# Altium schematic sheet 05. 4G Module.SchDoc
size A3
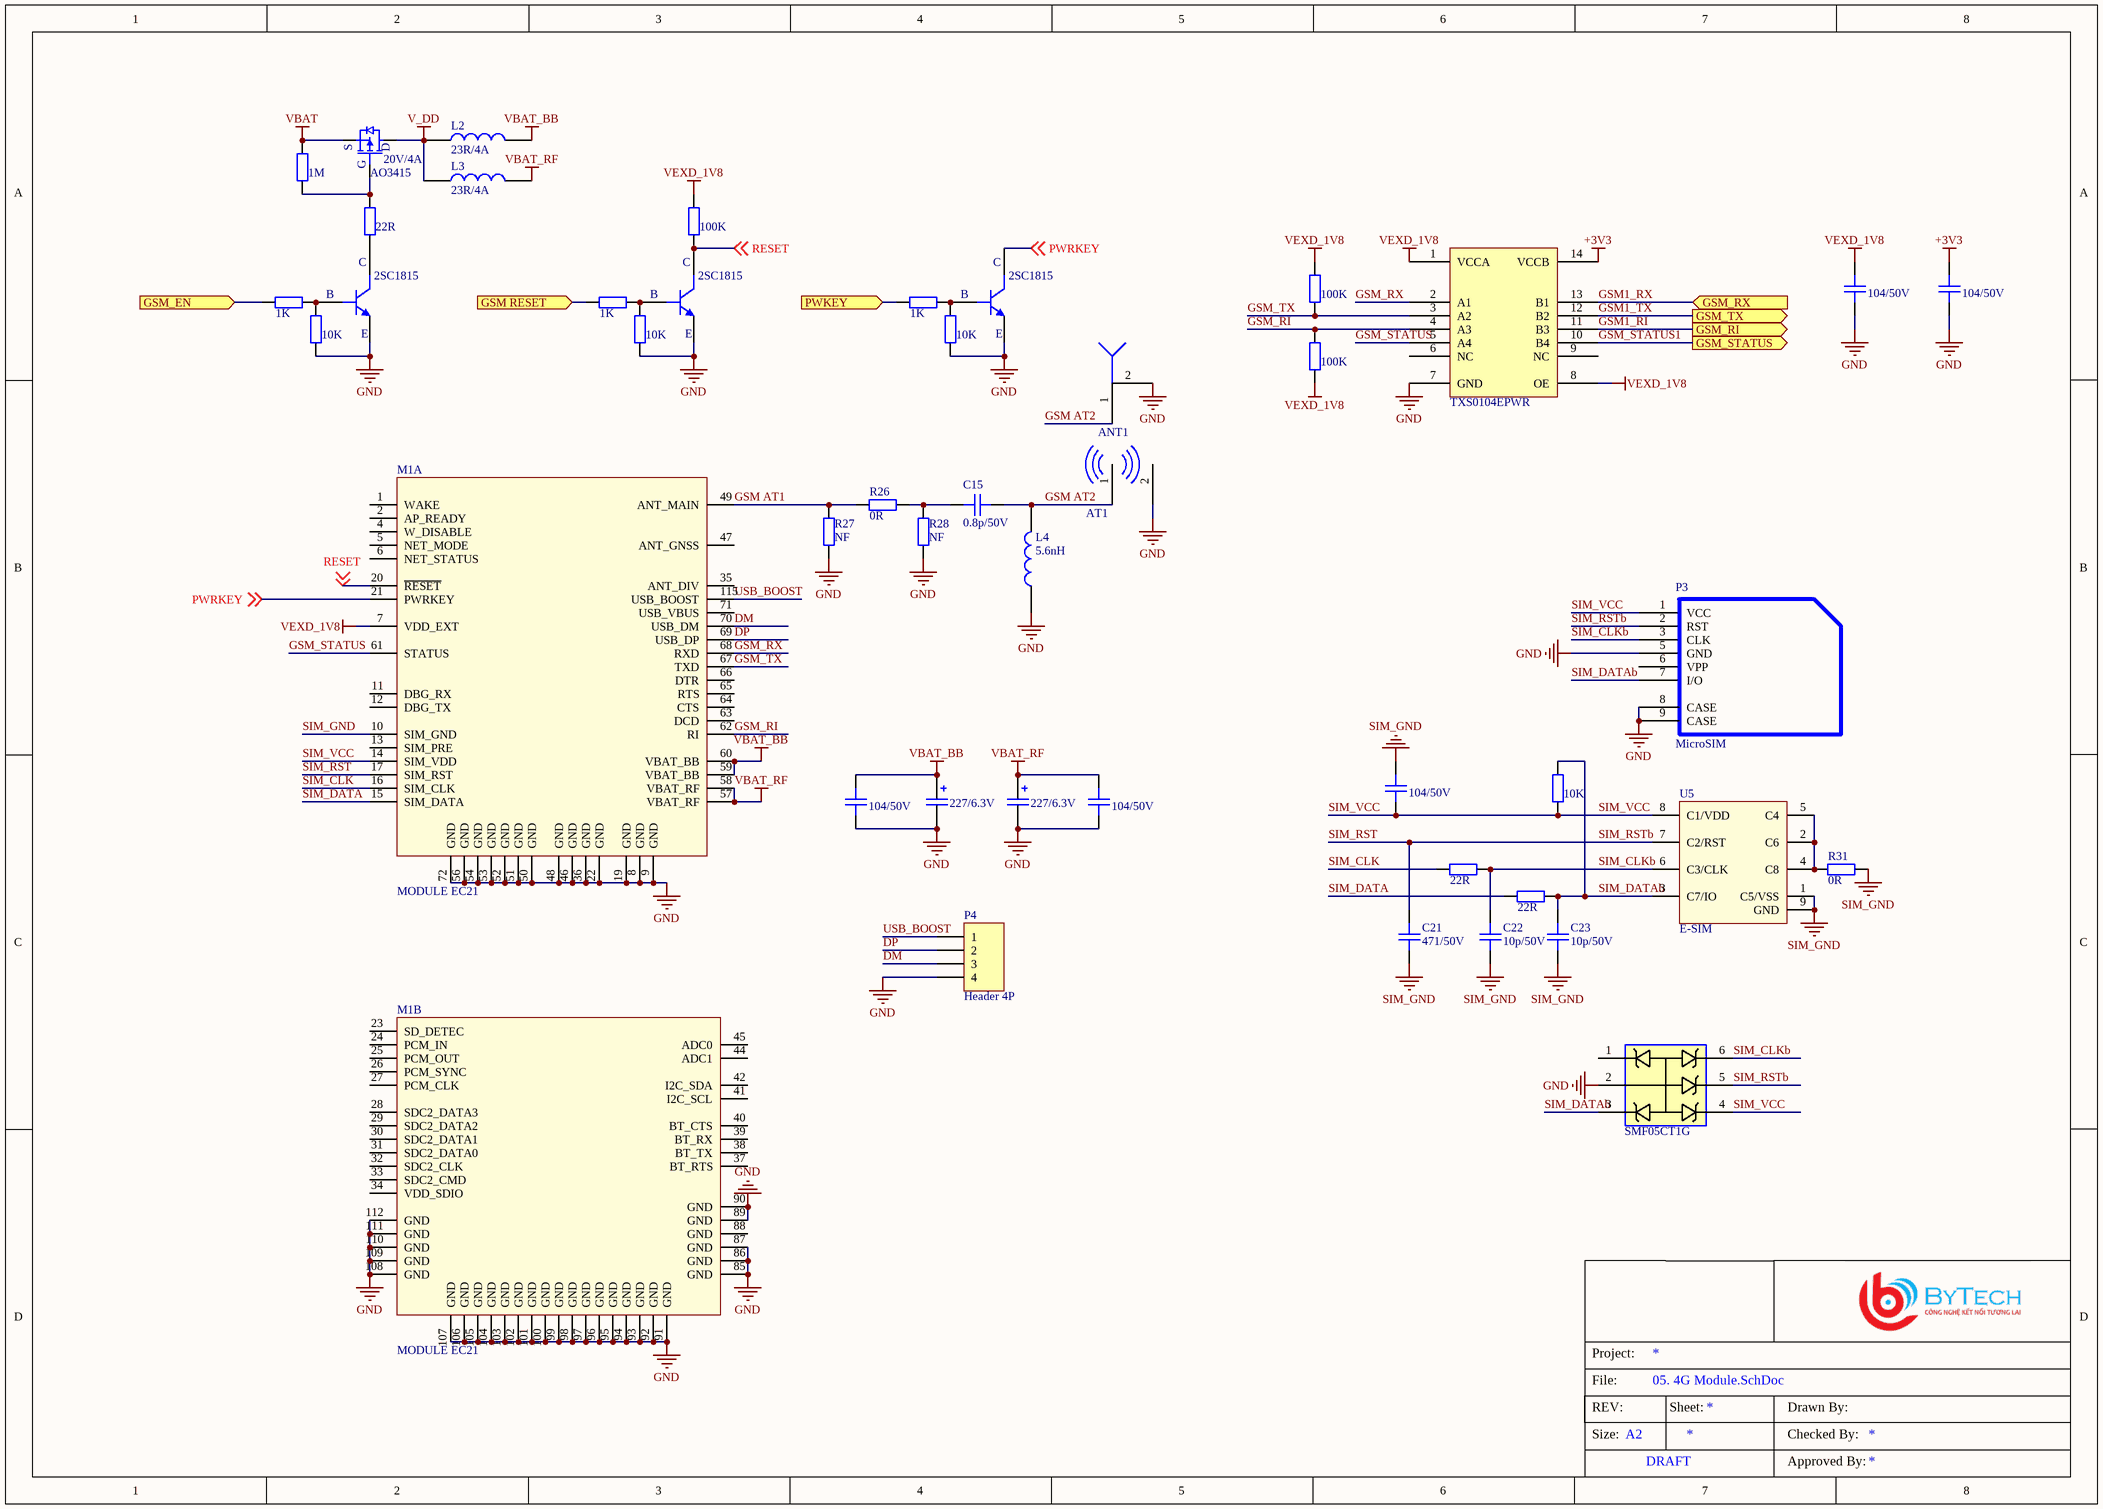
[diagram p0: 05. 4G Module.SchDoc]

## Parts
ANT1  (no value)  [Antenna 4G]
AT1  IPEX_CON  [ANTENNA - IPEX SMD]  (value not drawn)
C13  104/50V  [CAPC-0603 (1608)]
C14  104/50V  [CAPC-0603 (1608)]
C15  0.8p/50V  [CAPC-0603 (1608)]
C16  104/50V  [CAPC-0603 (1608)]
C17  227/6.3V  [CAP_TANTAL_1210(3528)]
C18  227/6.3V  [CAP_TANTAL_1210(3528)]
C19  104/50V  [CAPC-0603 (1608)]
C20  104/50V  [CAPC-0603 (1608)]
C21  471/50V  [CAPC-0603 (1608)]
C22  10p/50V  [CAPC-0603 (1608)]
C23  10p/50V  [CAPC-0603 (1608)]
D5  20V/4A  [SOT23_3]
L2  23R/4A  [IND-0603 (1608)]
L3  23R/4A  [IND-0603 (1608)]
L4  5.6nH  [IND-0603 (1608)]
M1  MODULE EC21  [EC21]  (parts A,B of 3)
P3  MicroSIM  [MUP-C792]
P4  Header 4P  [HDR1X4]
Q1  2SC1815  [SOT23_3]
Q2  2SC1815  [SOT23_3]
Q3  2SC1815  [SOT23_3]
R15  1M  [RESC-0603 (1608)]
R16  22R  [RESC-0603 (1608)]
R17  100K  [RESC-0603 (1608)]
R18  100K  [RESC-0603 (1608)]
R19  1K  [RESC-0603 (1608)]
R20  1K  [RESC-0603 (1608)]
R21  1K  [RESC-0603 (1608)]
R22  10K  [RESC-0603 (1608)]
R23  10K  [RESC-0603 (1608)]
R24  10K  [RESC-0603 (1608)]
R25  100K  [RESC-0603 (1608)]
R26  0R  [RESC-0603 (1608)]
R27  NF  [RESC-0603 (1608)]
R28  NF  [RESC-0603 (1608)]
R29  10K  [RESC-0603 (1608)]
R30  22R  [RESC-0603 (1608)]
R31  0R  [RESC-0603 (1608)]
R32  22R  [RESC-0603 (1608)]
U4  TXS0104EPWR  [TSOP65P640X120-14N]
U5  E-SIM  [MFF2 ESIM]
U6  SMF05CT1G  [SOT363]

## Ports
GSM RESET (in), GSM_EN (in), GSM_RI (out), GSM_RX (in), GSM_STATUS (out), GSM_TX (out), PWKEY (in)

## Nets
+3V3: C14.1 U4.14(VCCB)
GND: ANT1.2 AT1.2 C13.2 C14.2 C17.2 C18.2 C19.2 C20.2 L4.1 M1.8(GND) M1.9(GND) M1.19(GND) M1.22(GND) M1.36(GND) M1.46(GND) M1.48(GND) M1.50(GND) M1.51(GND) M1.52(GND) M1.53(GND) M1.54(GND) M1.56(GND) M1.72(GND) M1.85(GND) M1.86(GND) M1.87(GND) M1.89(GND) M1.90(GND) M1.91(GND) M1.92(GND) M1.93(GND) M1.94(GND) M1.95(GND) M1.96(GND) M1.97(GND) M1.98(GND) M1.99(GND) M1.100(GND) M1.101(GND) M1.102(GND) M1.103(GND) M1.104(GND) M1.105(GND) M1.106(GND) M1.107(GND) M1.108(GND) M1.109(GND) M1.110(GND) M1.111(GND) M1.112(GND) P3.5(GND) P3.8(CASE) P3.9(CASE) P4.4 Q1.2(E) Q2.2(E) Q3.2(E) R22.1 R23.1 R24.1 R27.1 R28.1 U4.7(GND) U6.2(AN)
SIM_GND: C16.1 C21.1 C22.1 C23.1 M1.10(SIM_GND) R31.2 U5.1(C5/VSS) U5.9(GND)
V_DD: D5.3(D) L2.1 L3.1
VBAT: D5.2(S) R15.2
VBAT_BB: C17.1 C19.1 L2.2 M1.59(VBAT_BB) M1.60(VBAT_BB)
VBAT_RF: C18.1 C20.1 L3.2 M1.57(VBAT_RF) M1.58(VBAT_RF)
VEXD_1V8: C13.1 M1.7(VDD_EXT) R17.2 R18.2 R25.2 U4.1(VCCA) U4.8(OE)
DM: M1.70(USB_DM) P4.3
DP: M1.69(USB_DP) P4.2
GSM1_RI: U4.11(B3) ; port GSM_RI
GSM1_RX: U4.13(B1) ; port GSM_RX
GSM1_TX: U4.12(B2) ; port GSM_TX
GSM AT1: M1.49(ANT_MAIN) R26.1 R27.2
GSM AT2: ANT1.1 AT1.1(AT) C15.2 L4.2
GSM RESET: R20.1 ; port GSM RESET
GSM_EN: R19.1 ; port GSM_EN
GSM_RI: M1.62(RI) R25.1 U4.4(A3)
GSM_RX: M1.68(RXD) U4.2(A1)
GSM_STATUS: M1.61(STATUS) U4.5(A4)
GSM_STATUS1: U4.10(B4) ; port GSM_STATUS
GSM_TX: M1.67(TXD) R18.1 U4.3(A2)
PWKEY: R21.1 ; port PWKEY
PWRKEY: M1.21(PWRKEY) Q3.3(C) ; off-sheet PWRKEY
RESET: M1.20(~{RESET}) Q2.3(C) R17.1 ; off-sheet RESET
SIM_CLK: M1.16(SIM_CLK) R30.1
SIM_CLKb: C22.2 P3.3(CLK) R30.2 U5.6(C3/CLK) U6.6(CT5)
SIM_DATA: M1.15(SIM_DATA) R32.1
SIM_DATAb: C23.2 P3.7(I/O) R29.2 R32.2 U5.3(C7/IO) U6.3(CT2)
SIM_RST: C21.2 M1.17(SIM_RST) P3.2(RST) U5.7(C2/RST) U6.5(CT4)  [also labelled SIM_RSTb]
SIM_VCC: C16.2 M1.14(SIM_VDD) P3.1(VCC) R29.1 U5.8(C1/VDD) U6.4(CT3)
USB_BOOST: M1.115(USB_BOOST) P4.1
NetC15_1: C15.1 R26.2 R28.2
NetD5_1: D5.1(G) R15.1 R16.2
NetQ1_1: Q1.1(B) R19.2 R22.2
NetQ1_3: Q1.3(C) R16.1
NetQ2_1: Q2.1(B) R20.2 R23.2
NetQ3_1: Q3.1(B) R21.2 R24.2
NetR31_1: R31.1 U5.2(C6) U5.4(C8) U5.5(C4)

Not connected (* = marked no-connect by the designer): M1 1(WAKE) 2(AP_READY) 4(W_DISABLE) 5(NET_MODE) 6(NET_STATUS) 11(DBG_RX) 12(DBG_TX) 13(SIM_PRE) 23(SD_DETEC) 24(PCM_IN) 25(PCM_OUT) 26(PCM_SYNC) 27(PCM_CLK) 28(SDC2_DATA3) 29(SDC2_DATA2) 30(SDC2_DATA1) 31(SDC2_DATA0) 32(SDC2_CLK) 33(SDC2_CMD) 34(VDD_SDIO) 35(ANT_DIV) 37(BT_RTS) 38(BT_TX) 39(BT_RX) 40(BT_CTS) 41(I2C_SCL) 42(I2C_SDA) 44(ADC1) 45(ADC0) 47(ANT_GNSS) 63(DCD) 64(CTS) 65(RTS) 66(DTR) 71(USB_VBUS) 88(GND); P3 6(VPP); U4 6(NC) 9(NC); U6 1(CT1)

## Notes on the sheet
- File:
- Project:
- REV:
- Size:
- A2
- Sheet:
- Drawn By:
- Checked By:
- DRAFT
- Approved By:

## Library data of the parts
ANT1 = PCB 4G CLONE: MPN: PCB 4G CLONE
AT1 = MUP-R4151: IPEX CONNECTER ANTENNA GPS GSM; MFR: MUP CONNECTOR; Solder: SMT; MPN: MUP-R4151; Value: IPEX_CON
C13 C14 C16 C19 C20 = C0603C104K5RACTU: CAP CER 0.1uF 50V 10% X7R 0603; CompanyID: VT-00982; Solder: SMT; MPN: C0603C104K5RACTU; Value: 104/50V
C15 = GRM1885C1HR80BA01D: CAP CER 0.8PF 50V C0G/NP0 0603; MFR: Murata Electronics; Solder: SMT; MPN: GRM1885C1HR80BA01D; Value: 0.8p/50V
C17 C18 = T520B227M006ATE035: CAP TANT POLY 220uF 20% 6.3V 3528 35mOhm ESR; Solder: SMT; CompanyID: VT-00643; Value: 227/6.3V; MPN: T520B227M006ATE035
C21 = CL10B471KB8NNNC: CAP CER 470pF 10% 50V X7R 0603; Solder: SMT; Company ID: VT00072; MPN: CL10B471KB8NNNC; Value: 471/50V
C22 C23 = CL10C100JB8NNND: CAP CER 10pF 5% 50V NP0 0603; Solder: SMT; Company ID: VT00076; Value: 10p/50V; MPN: CL10C100JB8NNND
D5 = AO3415: MOSFET P-CH 20V 4A SOT23; MFR: Alpha & Omega Semiconductor Inc.; CATEGORY: DIODE; SOLDER: SOT23; VALUE: 20V/4A; MPN: AO3415
L2 L3 = FBMJ1608HM230NT: IND-FERRITE BEAD 23 OHM  4A 0603 1LN; Solder: SMT; Company ID: VT00326; MPN: FBMJ1608HM230NT; Value: 23R/4A
L4 = 7447860056: FIXED IND 5.6NH 300MA 180 MOHM; MFR: Würth Elektronik; MPN: 7447860056; SOLDER: IND-0603; CATEGORY: INDUCTOR; Value: 5.6nH; Company ID: *
M1 = QUECTEL EC21: Quectel EC21 is a series of LTE category; MPN: EC21-CN; SOLDER: SMT; MFR: QUECTEL; CATEGORY: IC
P3 = MUP-C792: MicroSIM Card Push - Push Holder; MFR: MUPCONNECTOR; Company ID: VT00135; Solder: SMT; MPN: MUP-C792; Value: MUP-C792
P4 = Header 4x1: Header, 4 Pin Pitch 2.54mm; MPN: S1012EC-40-ND; Company ID: VT-00125; Solder: WAVE; Value: Header 4P
Q1-Q3 = 2SC1815: TRANS NPN 50V 0.15A SOT23-3; Solder: SMT; MPN: 2SC1815; Value: 2SC1815
R15 = CRCW06031M00FKEA: RES SMD 1M OHM 1% 1/10W 0603; CompanyID: VT-00325; Solder: SMT; MPN: CRCW06031M00FKEA; Value: 1M
R16 R30 R32 = RC0603FR-0722RL: RES SMD 22 OHM 1% 1/10W 0603; CompanyID: VT-00881; Solder: SMT; Value: 22R; MPN: RC0603FR-0722RL
R17 R18 R25 = RC0603FR-07100KL: RES SMD 100K OHM 1% 1/10W 0603; CompanyID: VT-00332; Solder: SMT; MPN: RC0603FR-07100KL; Value: 100K
R19-R21 = RC0603FR-071KL: RES SMD 1 KOHM 1% 1/10W 0603; CompanyID: VT-00574; Solder: SMT; MPN: RC0603FR-071KL; Value: 1K
R22-R24 R29 = RC0603FR-0710KL: RES SMD 10K OHM 1% 1/10W 0603; CompanyID: VT-00328; Solder: SMT; MPN: RC0603FR-0710KL; Value: 10K
R26 R31 = RC0603FR-070R: RES SMD 0 OHM 1% 1/10W 0603; Solder: SMT; Company ID: VT00423; Value: 0R; MPN: RC0603FR-070R
R27 R28 = RC0603FR-070R: RES SMD 0 OHM 1% 1/10W 0603; Solder: SMT; Value: 0R; Company ID: VT00423; MPN: RC0603FR-070R
U4 = TXS0104EPWR: IC 4BIT NON-INV TRANSLTR 14TSSOP; Solder: SMT; Value: TXS0104EPWR; MPN: TXS0104EPWR; Category: IC
U5 = SCM512: M2M communication module e-sim; MFR: ATC; SOLDER: WSON-8; MPN: SCM512; CATEGORY: IC; Value: E-SIM
U6 = SMF05CT1G: TVS DIODE 5VWM 12.5VC SC88; CompanyID: VT-00105; Solder: SMT; MPN: SMF05CT1G; Value: SMF05CT1G